# Altium schematic sheet MCU.SchDoc
size A3; Organization: Altium Limited; Address1: L3, 12a Rodborough Rd; Address2: Frenchs Forest; Address3: NSW; Address4: Australia 2086; SheetNumber: 3; SheetTotal: 7; SheetSize: A3
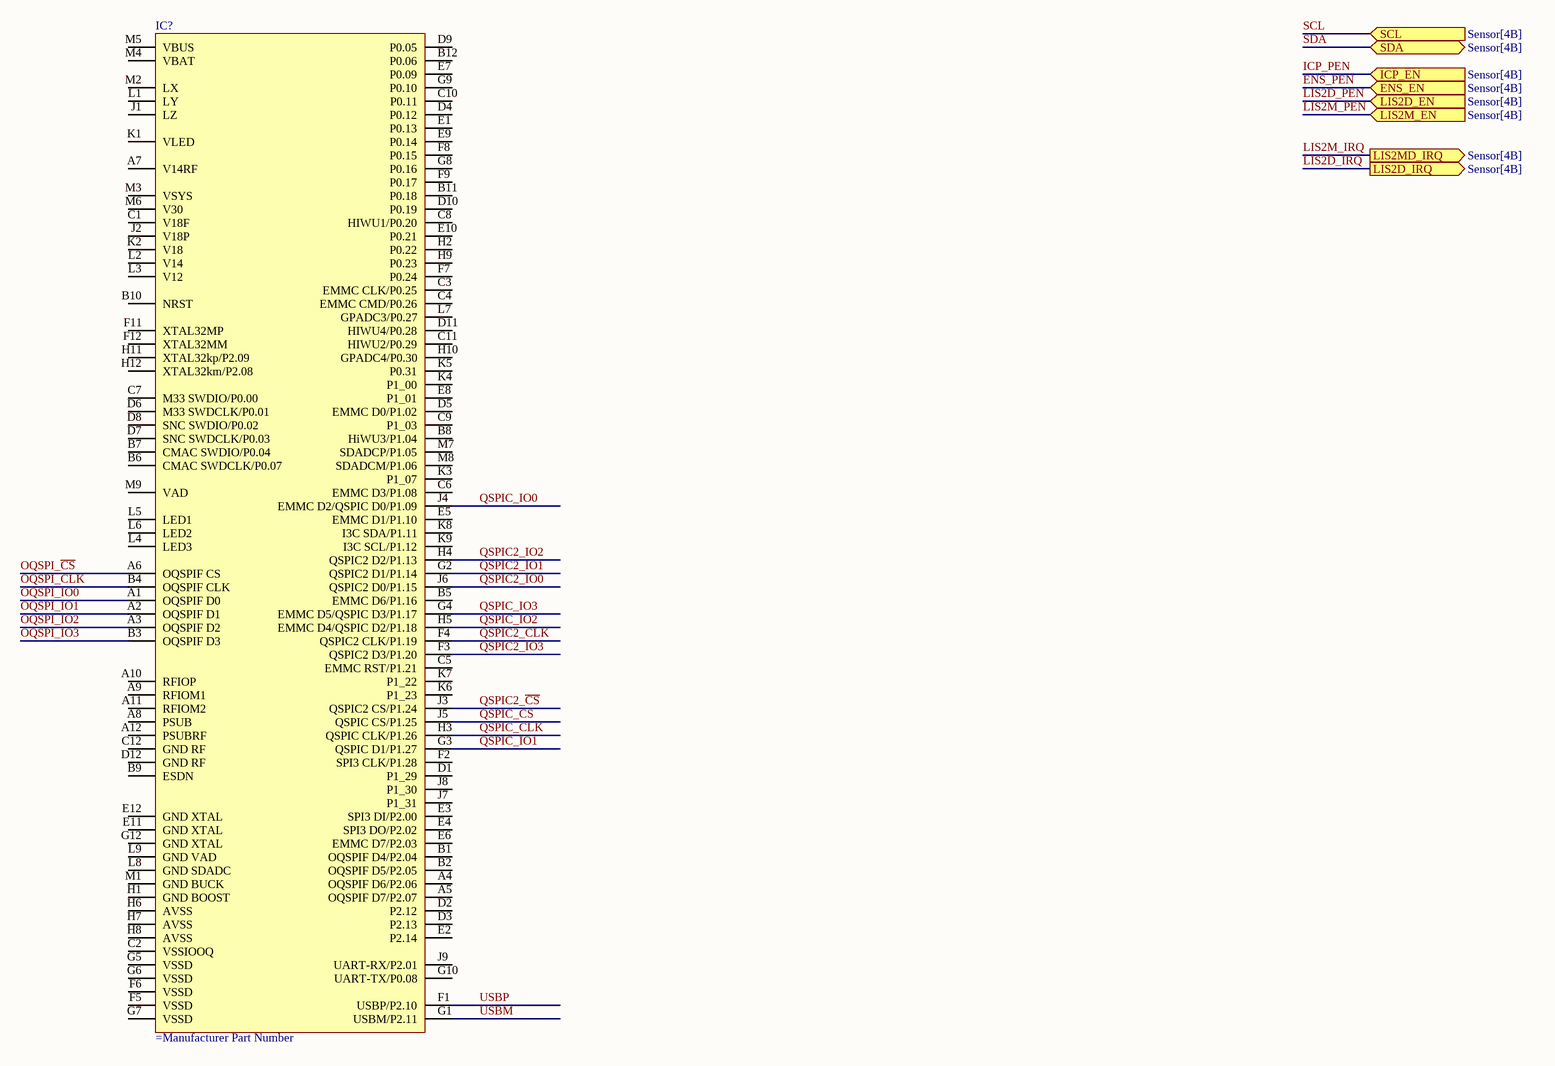
[diagram p0: MCU.SchDoc]

## Parts
IC?  (no value)  [DIALOG VFBGA142]

## Ports
ENS_EN (in, see Sensor[4B]), ICP_EN (in, see Sensor[4B]), LIS2D_EN (in, see Sensor[4B]), LIS2D_IRQ (out, see Sensor[4B]), LIS2M_EN (in, see Sensor[4B]), LIS2MD_IRQ (out, see Sensor[4B]), SCL (in, see Sensor[4B]), SDA (bidir, see Sensor[4B])

## Nets
ENS_PEN: port ENS_EN
ICP_PEN: port ICP_EN
LIS2D_IRQ: port LIS2D_IRQ
LIS2D_PEN: port LIS2D_EN
LIS2M_IRQ: port LIS2MD_IRQ
LIS2M_PEN: port LIS2M_EN
OQSPI_~{CS}: IC?.A6(OQSPIF_CS)
OQSPI_CLK: IC?.B4(OQSPIF_CLK)
OQSPI_IO0: IC?.A1(OQSPIF_D0)
OQSPI_IO1: IC?.A2(OQSPIF_D1)
OQSPI_IO2: IC?.A3(OQSPIF_D2)
OQSPI_IO3: IC?.B3(OQSPIF_D3)
QSPIC2_~{CS}: IC?.J3(QSPIC2_CS/P1.24)
QSPIC2_CLK: IC?.F4(QSPIC2_CLK/P1.19)
QSPIC2_IO0: IC?.J6(QSPIC2_D0/P1.15)
QSPIC2_IO1: IC?.G2(QSPIC2_D1/P1.14)
QSPIC2_IO2: IC?.H4(QSPIC2_D2/P1.13)
QSPIC2_IO3: IC?.F3(QSPIC2_D3/P1.20)
QSPIC_~{CS}: IC?.J5(QSPIC_CS/P1.25)
QSPIC_CLK: IC?.H3(QSPIC_CLK/P1.26)
QSPIC_IO0: IC?.J4(EMMC_D2/QSPIC_D0/P1.09)
QSPIC_IO1: IC?.G3(QSPIC_D1/P1.27)
QSPIC_IO2: IC?.H5(EMMC_D4/QSPIC_D2/P1.18)
QSPIC_IO3: IC?.G4(EMMC_D5/QSPIC_D3/P1.17)
SCL: port SCL
SDA: port SDA
USBM: IC?.G1(USBM/P2.11)
USBP: IC?.F1(USBP/P2.10)

Not connected (* = marked no-connect by the designer): IC? A4(OQSPIF_D6/P2.06) A5(OQSPIF_D7/P2.07) A7(V14RF) A8(PSUB) A9(RFIOM1) A10(RFIOP) A11(RFIOM2) A12(PSUBRF) B1(OQSPIF_D4/P2.04) B2(OQSPIF_D5/P2.05) B5(EMMC_D6/P1.16) B6(CMAC_SWDCLK/P0.07) B7(CMAC_SWDIO/P0.04) B8(HiWU3/P1.04) B9(ESDN) B10(NRST) B11(P0.18) B12(P0.06) C1(V18F) C2(VSSIOOQ) C3(EMMC_CLK/P0.25) C4(EMMC_CMD/P0.26) C5(EMMC_RST/P1.21) C6(EMMC_D3/P1.08) C7(M33_SWDIO/P0.00) C8(HIWU1/P0.20) C9(P1_03) C10(P0.11) C11(HIWU2/P0.29) C12(GND_RF) D1(P1_29) D2(P2.12) D3(P2.13) D4(P0.12) D5(EMMC_D0/P1.02) D6(M33_SWDCLK/P0.01) D7(SNC_SWDCLK/P0.03) D8(SNC_SWDIO/P0.02) D9(P0.05) D10(P0.19) D11(HIWU4/P0.28) D12(GND_RF) E1(P0.13) E2(P2.14) E3(SPI3_DI/P2.00) E4(SPI3_DO/P2.02) E5(EMMC_D1/P1.10) E6(EMMC_D7/P2.03) E7(P0.09) E8(P1_01) E9(P0.14) E10(P0.21) E11(GND_XTAL) E12(GND_XTAL) F2(SPI3_CLK/P1.28) F5(VSSD) F6(VSSD) F7(P0.24) F8(P0.15) F9(P0.17) F11(XTAL32MP) F12(XTAL32MM) G5(VSSD) G6(VSSD) G7(VSSD) G8(P0.16) G9(P0.10) G10(UART-TX/P0.08) G12(GND_XTAL) H1(GND_BOOST) H2(P0.22) H6(AVSS) H7(AVSS) H8(AVSS) H9(P0.23) H10(GPADC4/P0.30) H11(XTAL32kp/P2.09) H12(XTAL32km/P2.08) J1(LZ) J2(V18P) J7(P1_31) J8(P1_30) J9(UART-RX/P2.01) K1(VLED) K2(V18) K3(P1_07) K4(P1_00) K5(P0.31) K6(P1_23) K7(P1_22) K8(I3C_SDA/P1.11) K9(I3C_SCL/P1.12) L1(LY) L2(V14) L3(V12) L4(LED3) L5(LED1) L6(LED2) L7(GPADC3/P0.27) L8(GND_SDADC) L9(GND_VAD) M1(GND_BUCK) M2(LX) M3(VSYS) M4(VBAT) M5(VBUS) M6(V30) M7(SDADCP/P1.05) M8(SDADCM/P1.06) M9(VAD)

## Notes on the sheet
- Title:
- Size:
- Project:
- Revision:
- Sheet
- of
- Date:
- YıLDıZ IoT
- Elperek Mahallesi
- Saray Sokak, No:12
- SAKARYA / TURKEY
- File:

## Library data of the parts
IC? = DIALOG DA14706: DA14706 builds off the successes of Renesas SmartBond line, with Arm Cortex-M33F at 160 MHz as integrated application processors, 2D graphics processor, Voice Activity Detector (VAD) and Power Management Unit (PMU). With its ultra-low-power radio transceiver offering +6 dBm output power, and -97 dBm sensitivity combined with its software-configurable and upgradeable protocol engine (MAC), the DA14706 is capable of supporting Bluetooth low energy as well as multiple other 2.4GHz protocols. These unique f